# EAGLE schematic boardSchematic (EAGLE 7.3.0)
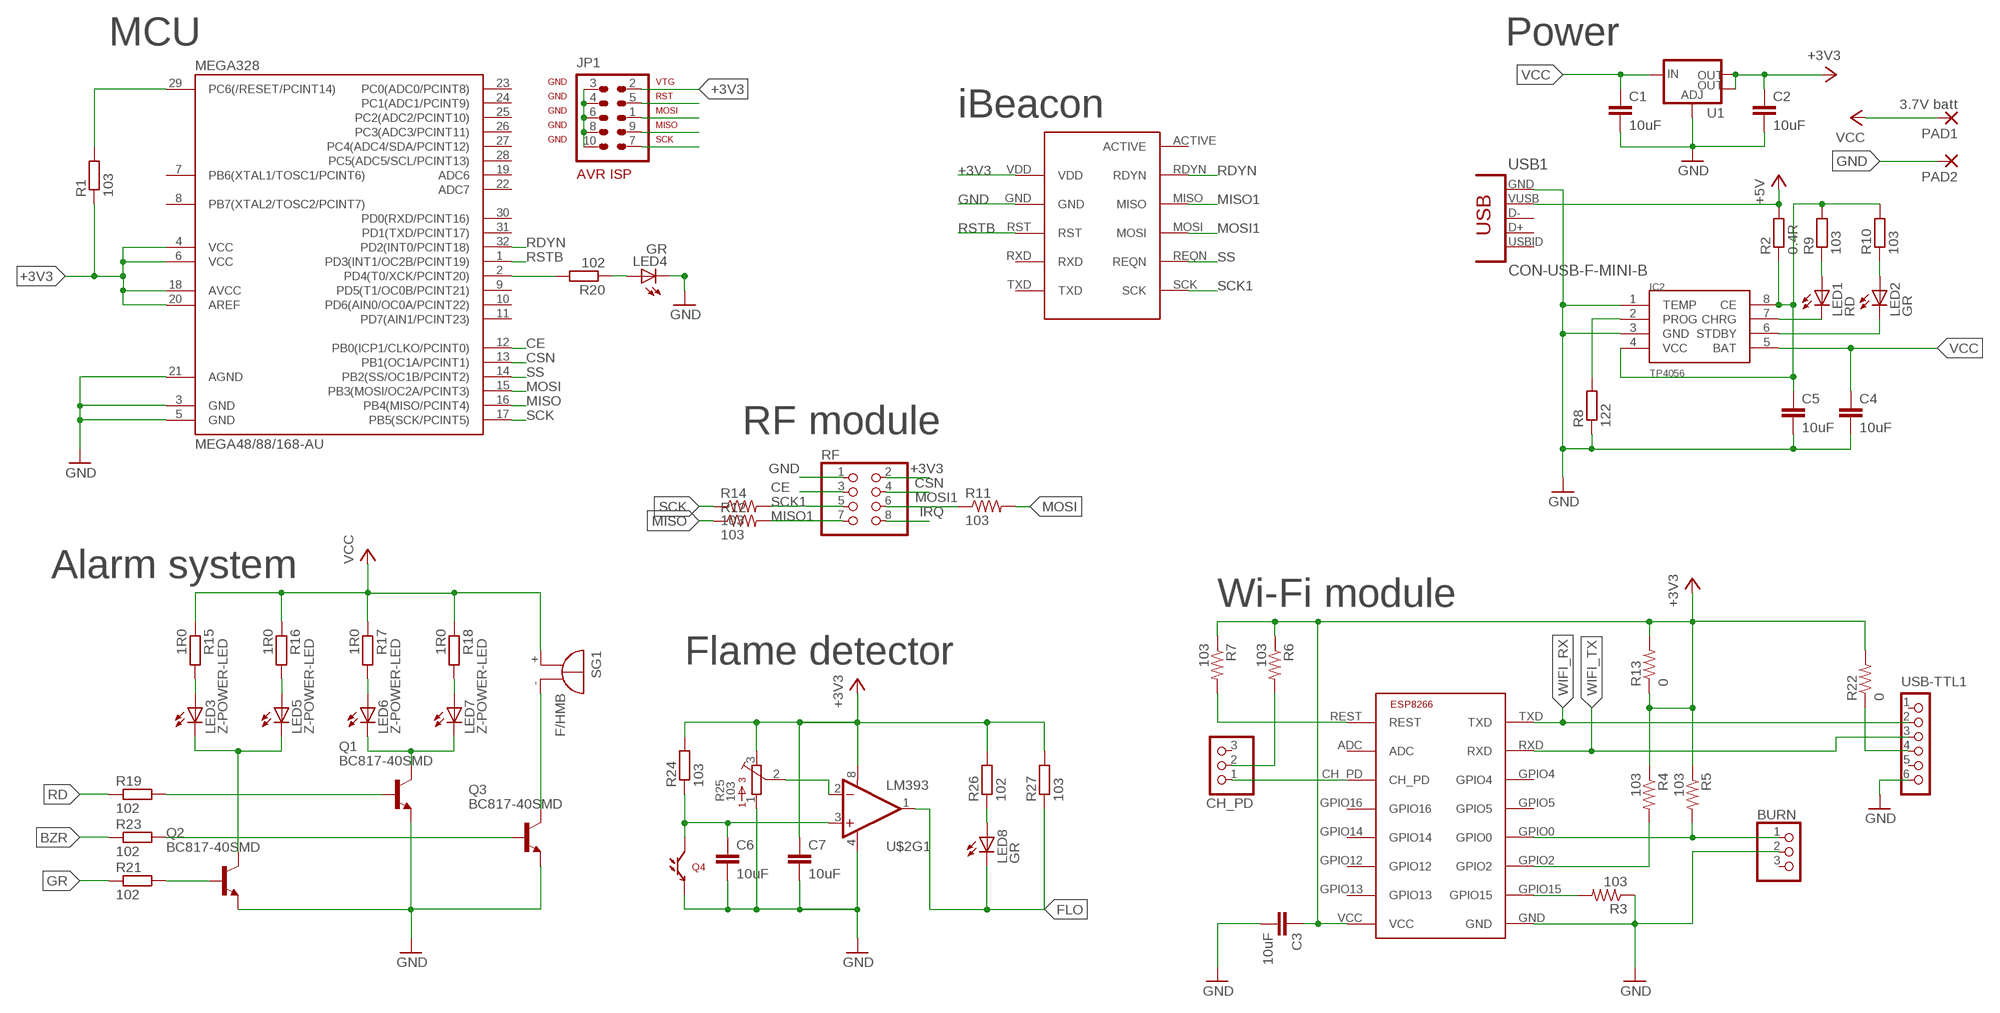
[diagram p0: schematic, sheet 1]

## Parts
BEACON  MOD-NRF8001MOD-NRF8001  [MOD-NRF8001]
BURN  PINHD-1X3  [1X03]
C1  10uF  C-EUC0805  [C0805]
C2  10uF  C-EUC0805  [C0805]
C3  10uF  C-EUC0805  [C0805]
C4  10uF  C-EUC1210  [C1210]
C5  10uF  C-EUC1210  [C1210]
C6  10uF  C-EUC0805  [C0805]
C7  10uF  C-EUC0805  [C0805]
CH_PD  PINHD-1X3  [1X03]
IC2  TP4056  [SOP-8]
JP1  AVR-ISP-10  [AVR-ISP-10]
LED1  RD  LEDSML0805  [SML0805]
LED2  GR  LEDSML0805  [SML0805]
LED3  Z-POWER-LED  [Z-POWER-LED-PCB-TYPE]
LED4  GR  LEDSML0805  [SML0805]
LED5  Z-POWER-LED  [Z-POWER-LED-PCB-TYPE]
LED6  Z-POWER-LED  [Z-POWER-LED-PCB-TYPE]
LED7  Z-POWER-LED  [Z-POWER-LED-PCB-TYPE]
LED8  GR  LEDSML0805  [SML0805]
MEGA328  MEGA48/88/168-AU  [TQFP32-08]
PAD1  3.7V batt  SMD5  [SMD2,54-5,08]
PAD2  SMD5  [SMD2,54-5,08]
Q1  BC817-40SMD  [SOT23-BEC]
Q2  BC817-40SMD  [SOT23-BEC]
Q3  BC817-40SMD  [SOT23-BEC]
Q4  LTR-301  [LTR-301]
R1  103  R-EU_R0805  [R0805]
R2  0.4R  R-EU_R1210W  [R1210W]
R3  103  R-US_R0805  [R0805]
R4  103  R-US_R0805  [R0805]
R5  103  R-US_R0805  [R0805]
R6  103  R-US_R0805  [R0805]
R7  103  R-US_R0805  [R0805]
R8  122  R-EU_R0805  [R0805]
R9  103  R-EU_R0805  [R0805]
R10  103  R-EU_R0805  [R0805]
R11  103  R-US_R0805  [R0805]
R12  103  R-US_R0805  [R0805]
R13  0  R-US_R1206  [R1206]
R14  103  R-US_R0805  [R0805]
R15  1R0  R-EU_R1206  [R1206]
R16  1R0  R-EU_R1206  [R1206]
R17  1R0  R-EU_R1206  [R1206]
R18  1R0  R-EU_R1206  [R1206]
R19  102  R-EU_R0805  [R0805]
R20  102  R-EU_R0805  [R0805]
R21  102  R-EU_R0805  [R0805]
R22  0  R-US_R1206  [R1206]
R23  102  R-EU_R0805  [R0805]
R24  103  R-EU_R0805  [R0805]
R25  103  3362P  [3362P]
R26  102  R-EU_R0805  [R0805]
R27  103  R-EU_R0805  [R0805]
RF  PINHD-2X4  [2X04]
SG1  F/HMB  [F/HMB]
U1  V_REG_LM1117SOT223  [SOT223]
U$1  ESP8266  [ESP-03]
U$2  LM393  [SO08]
USB1  CON-USB-F-MINI-B  [CONN_USB_MINI-B]
USB-TTL1  CON_HEADER_1X06-SMD-RIGHT-ANGLED  [M1X6_MALE_RIGHT_ANGLED_SMD]

## Nets
+3V3: BEACON.VDD C2.1 C3.1 C7.1 JP1.2 MEGA328.4(VCC) MEGA328.6(VCC) MEGA328.18(AVCC) MEGA328.20(AREF) R1.1 R4.1 R5.1 R6.1 R7.1 R13.1 R13.2 R22.2 R24.2 R25.3 R26.2 R27.2 RF.2 U1.2(OUT) U1.4(OUT) U$1.VCC U$2.8(V+)
+5V: R2.2 USB1.VUSB
BZR: R23.1
CE: MEGA328.12(PB0(ICP1/CLKO/PCINT0)) RF.3
CSN: MEGA328.13(PB1(OC1A/PCINT1)) RF.4
FLO: LED8.C R27.1 U$2.1(OUT)
GND: BEACON.GND BURN.2 C1.2 C2.2 C3.2 C4.2 C5.2 C6.2 C7.2 IC2.1(TEMP) IC2.3(GND) JP1.3 JP1.4 JP1.6 JP1.8 JP1.10 LED4.C MEGA328.3(GND) MEGA328.5(GND) MEGA328.21(AGND) PAD2.1(P) Q1.E Q2.E Q3.E Q4.E R3.1 R8.1 R25.1 RF.1 U1.1(ADJ) U$1.GND U$2.4(V-) USB1.GND USB-TTL1.6
GR: R21.1
IRQ: RF.8
MISO: JP1.9 MEGA328.16(PB4(MISO/PCINT4)) R12.1
MISO1: BEACON.MISO R12.2 RF.7
MOSI: JP1.1 MEGA328.15(PB3(MOSI/OC2A/PCINT3)) R11.2
MOSI1: BEACON.MOSI R11.1 RF.6
N$1: Q2.B R21.2
N$2: LED1.A R9.1
N$3: CH_PD.1 U$1.CH_PD
N$4: Q1.B R19.2
N$5: R3.2 U$1.GPIO15
N$6: LED2.A R10.1
N$7: R4.2 U$1.GPIO2
N$8: IC2.7(CHRG) LED1.C
N$9: BURN.1 R5.2 U$1.GPIO0
N$10: IC2.6(STDBY) LED2.C
N$11: IC2.2(PROG) R8.2
N$12: CH_PD.2 R6.2
N$13: R7.2 U$1.REST
N$14: C5.1 IC2.4(VCC) IC2.8(CE) R2.1 R9.2 R10.2
N$15: LED3.A R15.2
N$16: LED5.A R16.2
N$17: LED6.A R17.2
N$18: LED7.A R18.2
N$19: LED6.C LED7.C Q1.C
N$20: LED3.C LED5.C Q2.C
N$21: Q3.B R23.2
N$22: C6.1 Q4.C R24.1 U$2.3(+IN)
N$23: Q3.C SG1.-
N$24: R25.2 U$2.2(-IN)
N$25: LED8.A R26.1
N$26: LED4.A R20.1
N$27: R22.1 USB-TTL1.4
N$29: MEGA328.2(PD4(T0/XCK/PCINT20)) R20.2
RD: R19.1
RDYN: BEACON.RDYN MEGA328.32(PD2(INT0/PCINT18))
RST: JP1.5 MEGA328.29(PC6(/RESET/PCINT14)) R1.2
RSTB: BEACON.RST MEGA328.1(PD3(INT1/OC2B/PCINT19))
SCK: JP1.7 MEGA328.17(PB5(SCK/PCINT5)) R14.1
SCK1: BEACON.SCK R14.2 RF.5
SS: BEACON.REQN MEGA328.14(PB2(SS/OC1B/PCINT2))
VCC: C1.1 C4.1 IC2.5(BAT) PAD1.1(P) R15.1 R16.1 R17.1 R18.1 SG1.+ U1.3(IN)
WIFI_RX: U$1.TXD USB-TTL1.2
WIFI_TX: U$1.RXD USB-TTL1.3
Unconnected: BEACON.ACTIVE BEACON.RXD BEACON.TXD BURN.3 CH_PD.3 MEGA328.7(PB6(XTAL1/TOSC1/PCINT6)) MEGA328.8(PB7(XTAL2/TOSC2/PCINT7)) MEGA328.9(PD5(T1/OC0B/PCINT21)) MEGA328.10(PD6(AIN0/OC0A/PCINT22)) MEGA328.11(PD7(AIN1/PCINT23)) MEGA328.19(ADC6) MEGA328.22(ADC7) MEGA328.23(PC0(ADC0/PCINT8)) MEGA328.24(PC1(ADC1/PCINT9)) MEGA328.25(PC2(ADC2/PCINT10)) MEGA328.26(PC3(ADC3/PCINT11)) MEGA328.27(PC4(ADC4/SDA/PCINT12)) MEGA328.28(PC5(ADC5/SCL/PCINT13)) MEGA328.30(PD0(RXD/PCINT16)) MEGA328.31(PD1(TXD/PCINT17)) U$1.ADC U$1.GPIO4 U$1.GPIO5 U$1.GPIO12 U$1.GPIO13 U$1.GPIO14 U$1.GPIO16 U$2.5(+IN) U$2.6(-IN) U$2.7(OUT) USB1.BODY@1(BODY) USB1.BODY@2(BODY) USB1.BODY@3(BODY) USB1.BODY@4(BODY) USB1.D+ USB1.D- USB1.ID(USBID) USB-TTL1.1 USB-TTL1.5

## Notes on the sheet
- MCU | Power
- iBeacon
- RF module
- Alarm system
- Wi-Fi module
- Flame detector

## Library data of the parts
BEACON = frankduerr:MOD-NRF8001
BURN CH_PD = pinhead:PINHD-1X3: PIN HEADER
C1-C7 = rcl:C-EU: CAPACITOR, European symbol
IC2 = TP4056:TP4056
JP1 = avr-4:AVR-ISP-10: AVR ISP-10 Serial Programming Header
LED1 LED2 LED4 LED8 = led:LED: LED OSRAM: - CHIPLED LG R971, LG N971, LY N971, LG Q971, LY Q971, LO R971, LY R971 LH N974, LH R974 LS Q976, LO Q976, LY Q976 LO Q996 - Hyper CHIPLED LW Q18S LB Q993, LB Q99A, LB R99A - SideLED LS A670, LO A670, LY A670, LG A670, LP A670 LB A673, LV A673, LT A673, LW A673 LH A674 LY A675 LS A676, LA A676, LO A676, LY A676, LW A676 LS A679, LY A679, LG A679 - Hyper Micro SIDELED® LS Y876, LA Y876, LO Y876, LY Y876 LT Y87S - SmartLED LW L88C, LW L88S LB L89C, LB L89S, LG L890 LS L89K, LO L89K, LY L89K LS L896, LA L896, LO L896, LY L896 - TOPLED LS T670, LO T670, LY T670, LG T670, LP T670 LSG T670, LSP T670, LSY T670, LOP T670, LYG T670 LG T671, LOG T671, LSG T671 LB T673, LV T673, LT T673, LW T673 LH T674 LS T676, LA T676, LO T676, LY T676, LB T676, LH T676, LSB T676, LW T676 LB T67C, LV T67C, LT T67C, LS T67K, LO T67K, LY T67K, LW E67C LS E67B, LA E67B, LO E67B, LY E67B, LB E67C, LV E67C, LT E67C LW T67C LS T679, LY T679, LG T679 LS T770, LO T770, LY T770, LG T770, LP T770 LB T773, LV T773, LT T773, LW T773 LH T774 LS E675, LA E675, LY E675, LS T675 LS T776, LA T776, LO T776, LY T776, LB T776 LHGB T686 LT T68C, LB T68C - Hyper Mini TOPLED® LB M676 - Mini TOPLED Santana® LG M470 LS M47K, LO M47K, LY M47K Source: http://www.osram.convergy.de LUXEON: - LUMILED® LXK2-PW12-R00, LXK2-PW12-S00, LXK2-PW14-U00, LXK2-PW14-V00 LXK2-PM12-R00, LXK2-PM12-S00, LXK2-PM14-U00 LXK2-PE12-Q00, LXK2-PE12-R00, LXK2-PE12-S00, LXK2-PE14-T00, LXK2-PE14-U00 LXK2-PB12-K00, LXK2-PB12-L00, LXK2-PB12-M00, LXK2-PB14-N00, LXK2-PB14-P00, LXK2-PB14-Q00 LXK2-PR12-L00, LXK2-PR12-M00, LXK2-PR14-Q00, LXK2-PR14-R00 LXK2-PD12-Q00, LXK2-PD12-R00, LXK2-PD12-S00 LXK2-PH12-R00, LXK2-PH12-S00 LXK2-PL12-P00, LXK2-PL12-Q00, LXK2-PL12-R00 Source: www.luxeon.com KINGBRIGHT: KA-3528ASYC Source: www.kingbright.com
LED3 LED5-LED7 = led:Z-POWER-LED: Z-Power LED Source: http://www.seoulsemicon.co.kr .. X42182.pdf
MEGA328 = avr-4:MEGA48/88/168
PAD1 PAD2 = wirepad:SMD5: SMD PAD
Q1-Q3 = transistor-npn:BC817*: NPN Transistor
Q4 = SparkFun-Sensors:LTR-301: Through-hole side-receiving IR phototransistor
R1 R2 R8-R10 R15-R21 R23 R24 R26 R27 = rcl:R-EU_: RESISTOR, European symbol
R3-R7 R11-R14 R22 = rcl:R-US_: RESISTOR, American symbol
R25 = bourns:3362: 3362 Series 1/4" Square Trimmer
RF = pinhead:PINHD-2X4: PIN HEADER
SG1 = buzzer:F/HMB: BUZZER Source: Buerklin
U1 = powerIC:V_REG_LM1117: Voltage Regulator LM1117 Standard adjustable voltage regulator but in SMD form. Spark Fun Electronics SKU : COM-00595; PROD_ID: VREG-08170
U$1 = ESP8266:ESP8266: low cost Wifi to Serial Module
U$2 = SparkFun-AnalogIC:LM393: Low-voltage comparator
USB1 = dp_devices:CON-USB-F: USB Female connector
USB-TTL1 = dp_devices:CON_HEADER_1X06